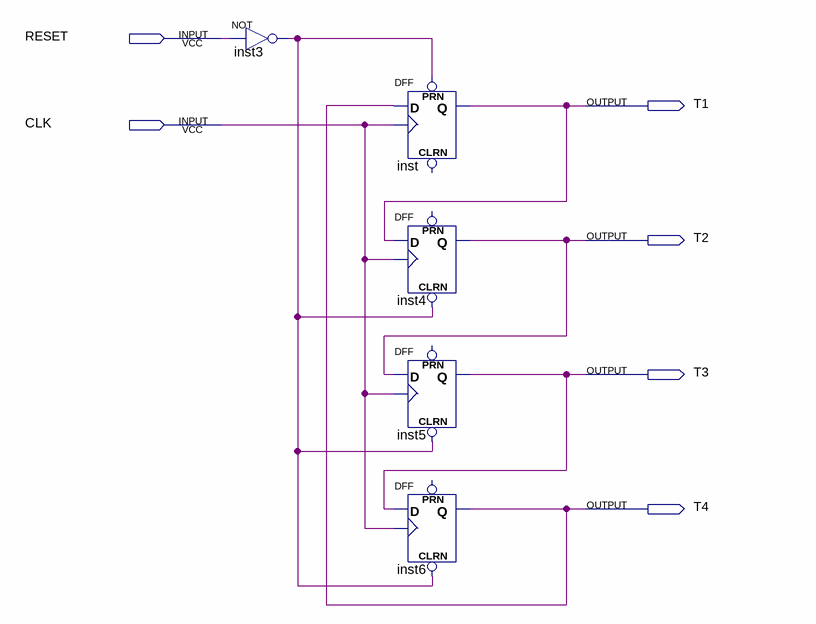
[diagram p0: schematic sheet]
// Quartus schematic CPU_4T_test1.bdf as structural Verilog: 5 symbols, 6 pins
module CPU_4T_test1 (
  input  RESET,
  input  CLK,
  output T1,
  output T2,
  output T3,
  output T4
);

  wire inst3_out;

  not inst3 (inst3_out, RESET);
  DFF inst (.CLK(CLK), .D(T4), .PRN(inst3_out), .Q(T1));  // open: CLRN
  DFF inst4 (.CLRN(inst3_out), .CLK(CLK), .D(T1), .Q(T2));  // open: PRN
  DFF inst5 (.CLRN(inst3_out), .CLK(CLK), .D(T2), .Q(T3));  // open: PRN
  DFF inst6 (.CLRN(inst3_out), .CLK(CLK), .D(T3), .Q(T4));  // open: PRN
endmodule
